# EAGLE design FM1608-6116-adaptor-AR (EAGLE 7.7.0)
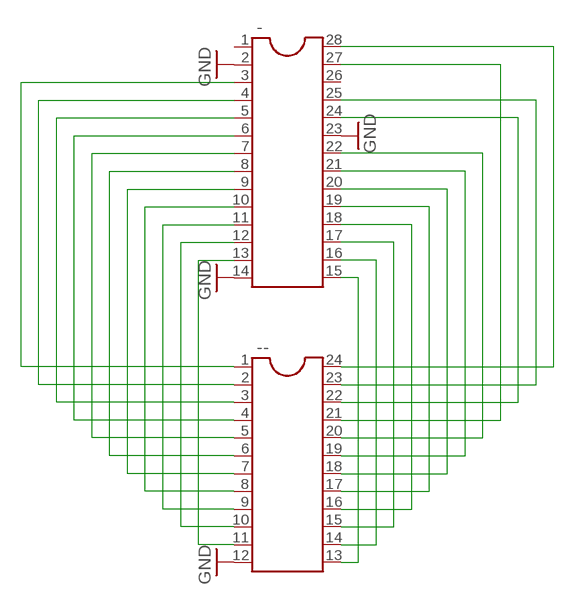
[diagram p0: schematic, sheet 1]

## Parts
-  DIL28  [DIL28-6]
--  DIL24-6  [DIL24-6]

## Nets
GND: --.12 -.2 -.14 -.23
N$1: --.13 -.15
N$2: --.14 -.16
N$3: --.15 -.17
N$4: --.16 -.18
N$5: --.17 -.19
N$6: --.18 -.20
N$7: --.19 -.21
N$8: --.20 -.22
N$9: --.11 -.13
N$10: --.10 -.12
N$11: --.9 -.11
N$12: --.8 -.10
N$13: --.7 -.9
N$14: --.6 -.8
N$15: --.5 -.7
N$16: --.4 -.6
N$17: --.3 -.5
N$18: --.2 -.4
N$19: --.1 -.3
N$20: --.21 -.27
N$21: --.22 -.24
N$22: --.23 -.25
N$23: --.24 -.28
Unconnected: -.1 -.26

## Library data of the parts
- = ic-package:DIL28: Dual In Line
-- = ic-package:DIL24: Dual In Line

## Board
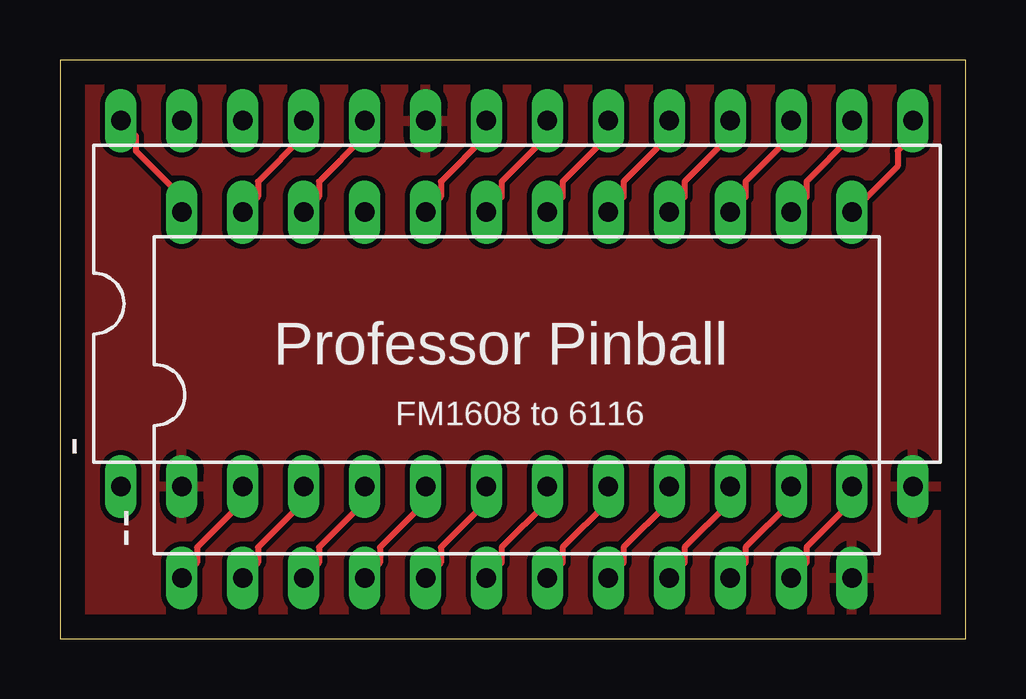
[diagram p1: board, top side]
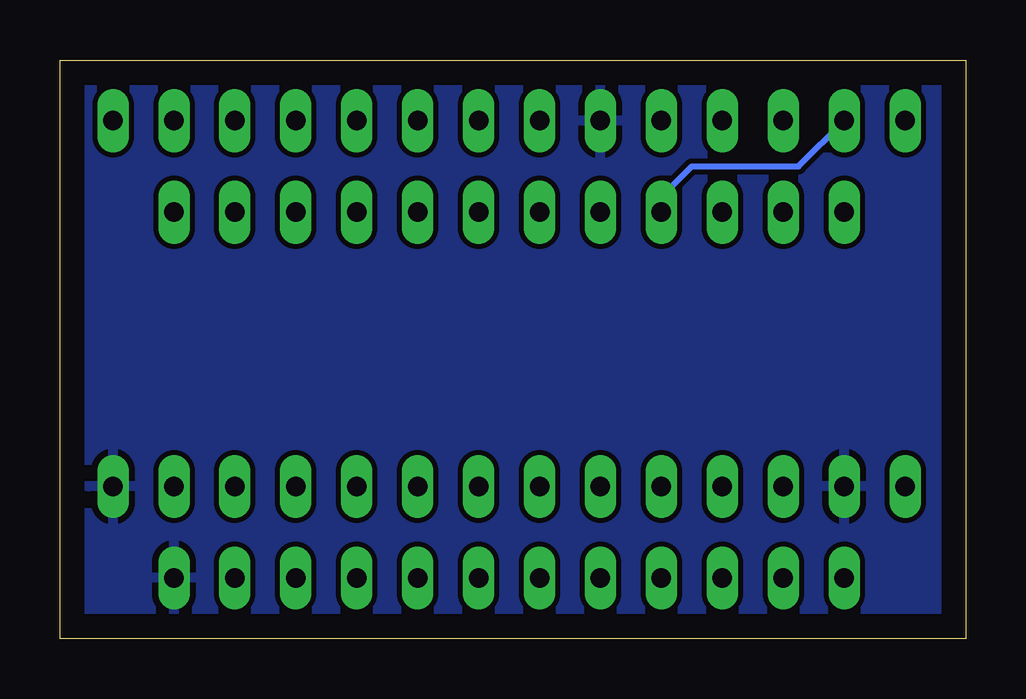
[diagram p2: board, bottom side, seen from below]

Size 37.77 x 24.12 mm. Coordinates in mm from the lower left corner, seen from the top.
Outline: 0,0 37.77,0 37.77,24.12 0,24.12 0,0
Copper layers (1*16): Top 0.035mm / dielectric 1.5mm / Bottom 0.035mm
Design rules "default": minimum track width 10mil, minimum drill 24mil, track to track 8mil, track to pad 8mil, pad to pad 8mil, via to via 8mil, smd to smd 8mil, copper to edge 40mil, drill to drill 8mil, minimum pad ring 10mil, minimum via ring 8mil, stop-mask expansion 4mil, vias tented up to drill 0mil, thermal gap 10mil

### Footprints (pad centres in the part's own frame; a part is rotated, then mirrored left to right if it is on the bottom)
DIL28-6 = drill 0.813 long: 1 -16.51,-7.62; 2 -13.97,-7.62; 3 -11.43,-7.62; 4 -8.89,-7.62; 5 -6.35,-7.62; 6 -3.81,-7.62; 7 -1.27,-7.62; 8 1.27,-7.62; 9 3.81,-7.62; 10 6.35,-7.62; 11 8.89,-7.62; 12 11.43,-7.62; 13 13.97,-7.62; 14 16.51,-7.62; 15 16.51,7.62; 16 13.97,7.62; 17 11.43,7.62; 18 8.89,7.62; 19 6.35,7.62; 20 3.81,7.62; 21 1.27,7.62; 22 -1.27,7.62; 23 -3.81,7.62; 24 -6.35,7.62; 25 -8.89,7.62; 26 -11.43,7.62; 27 -13.97,7.62; 28 -16.51,7.62
DIL24-6 = drill 0.813 long: 1 -13.97,-7.62; 2 -11.43,-7.62; 3 -8.89,-7.62; 4 -6.35,-7.62; 5 -3.81,-7.62; 6 -1.27,-7.62; 7 1.27,-7.62; 8 3.81,-7.62; 9 6.35,-7.62; 10 8.89,-7.62; 11 11.43,-7.62; 12 13.97,-7.62; 13 13.97,7.62; 14 11.43,7.62; 15 8.89,7.62; 16 6.35,7.62; 17 3.81,7.62; 18 1.27,7.62; 19 -1.27,7.62; 20 -3.81,7.62; 21 -6.35,7.62; 22 -8.89,7.62; 23 -11.43,7.62; 24 -13.97,7.62

### Placement (x,y rotation side)
-  19.05,13.97 0 top
--  19.05,10.16 0 top

### Tracks (layer width: path | path; a pad name or v marks a point on that pad's centre or on a via)
GND
  pour Top: -1.27,25.4 -1.27,-2.54 40.64,-2.54 40.64,25.4
  pour Bottom: -2.54,26.67 -2.54,-1.27 39.37,-1.27 39.37,26.67
N$1
  Top 0.254: --.13 34.92,19.68 34.92,20.32 35.56,20.95 -.15
N$2
  Top 0.254: --.14 31.11,18.41 31.11,19.05 33.02,20.95 -.16
N$3
  Top 0.254: --.15 28.57,18.41 28.57,19.05 30.48,20.95 -.17
N$4
  Top 0.254: --.16 26.04,18.41 26.04,19.05 27.94,20.95 -.18
N$5
  Top 0.254: --.17 23.5,18.41 23.5,19.05 25.4,20.95 -.19
N$6
  Top 0.254: --.18 20.95,18.41 20.95,19.05 22.86,20.95 -.20
N$7
  Top 0.254: --.19 18.41,18.41 18.41,19.05 20.32,20.95 -.21
N$8
  Top 0.254: --.20 15.88,18.41 15.88,19.05 17.78,20.95 -.22
N$9
  Top 0.254: --.11 31.11,3.17 31.11,3.81 33.02,5.71 -.13
N$10
  Top 0.254: --.10 28.57,3.17 28.57,3.81 30.48,5.71 -.12
N$11
  Top 0.254: --.9 26.04,3.17 26.04,3.81 27.94,5.71 -.11
N$12
  Top 0.254: --.8 23.5,3.17 23.5,3.81 25.4,5.71 -.10
N$13
  Top 0.254: --.7 20.95,3.17 20.95,3.81 22.86,5.71 -.9
N$14
  Top 0.254: --.6 18.41,3.17 18.41,3.81 20.32,5.71 -.8
N$15
  Top 0.254: --.5 15.88,3.17 15.88,3.81 17.78,5.71 -.7
N$16
  Top 0.254: --.4 13.34,3.17 13.34,3.81 15.24,5.71 -.6
N$17
  Top 0.254: --.3 10.79,3.17 10.79,3.81 12.7,5.71 -.5
N$18
  Top 0.254: --.2 8.26,3.17 8.26,3.81 10.16,5.71 -.4
N$19
  Top 0.254: --.1 5.71,3.17 5.71,3.81 7.62,5.71 -.3
N$20
  Bottom 0.254: -.27 6.99,19.68 11.43,19.68 12.7,18.41 --.21
N$21
  Top 0.254: --.22 10.79,18.41 10.79,19.05 12.7,20.95 -.24
N$22
  Top 0.254: --.23 8.26,18.41 8.26,19.05 10.16,20.95 -.25
N$23
  Top 0.254: -.28 3.17,20.95 3.17,20.32 5.08,18.41 --.24

### Text on the board
tPlace: Professor Pinball | FM1608 to 6116